# EAGLE design Mixer-Analog-LM3900-Rev-C (EAGLE 8.4.3)
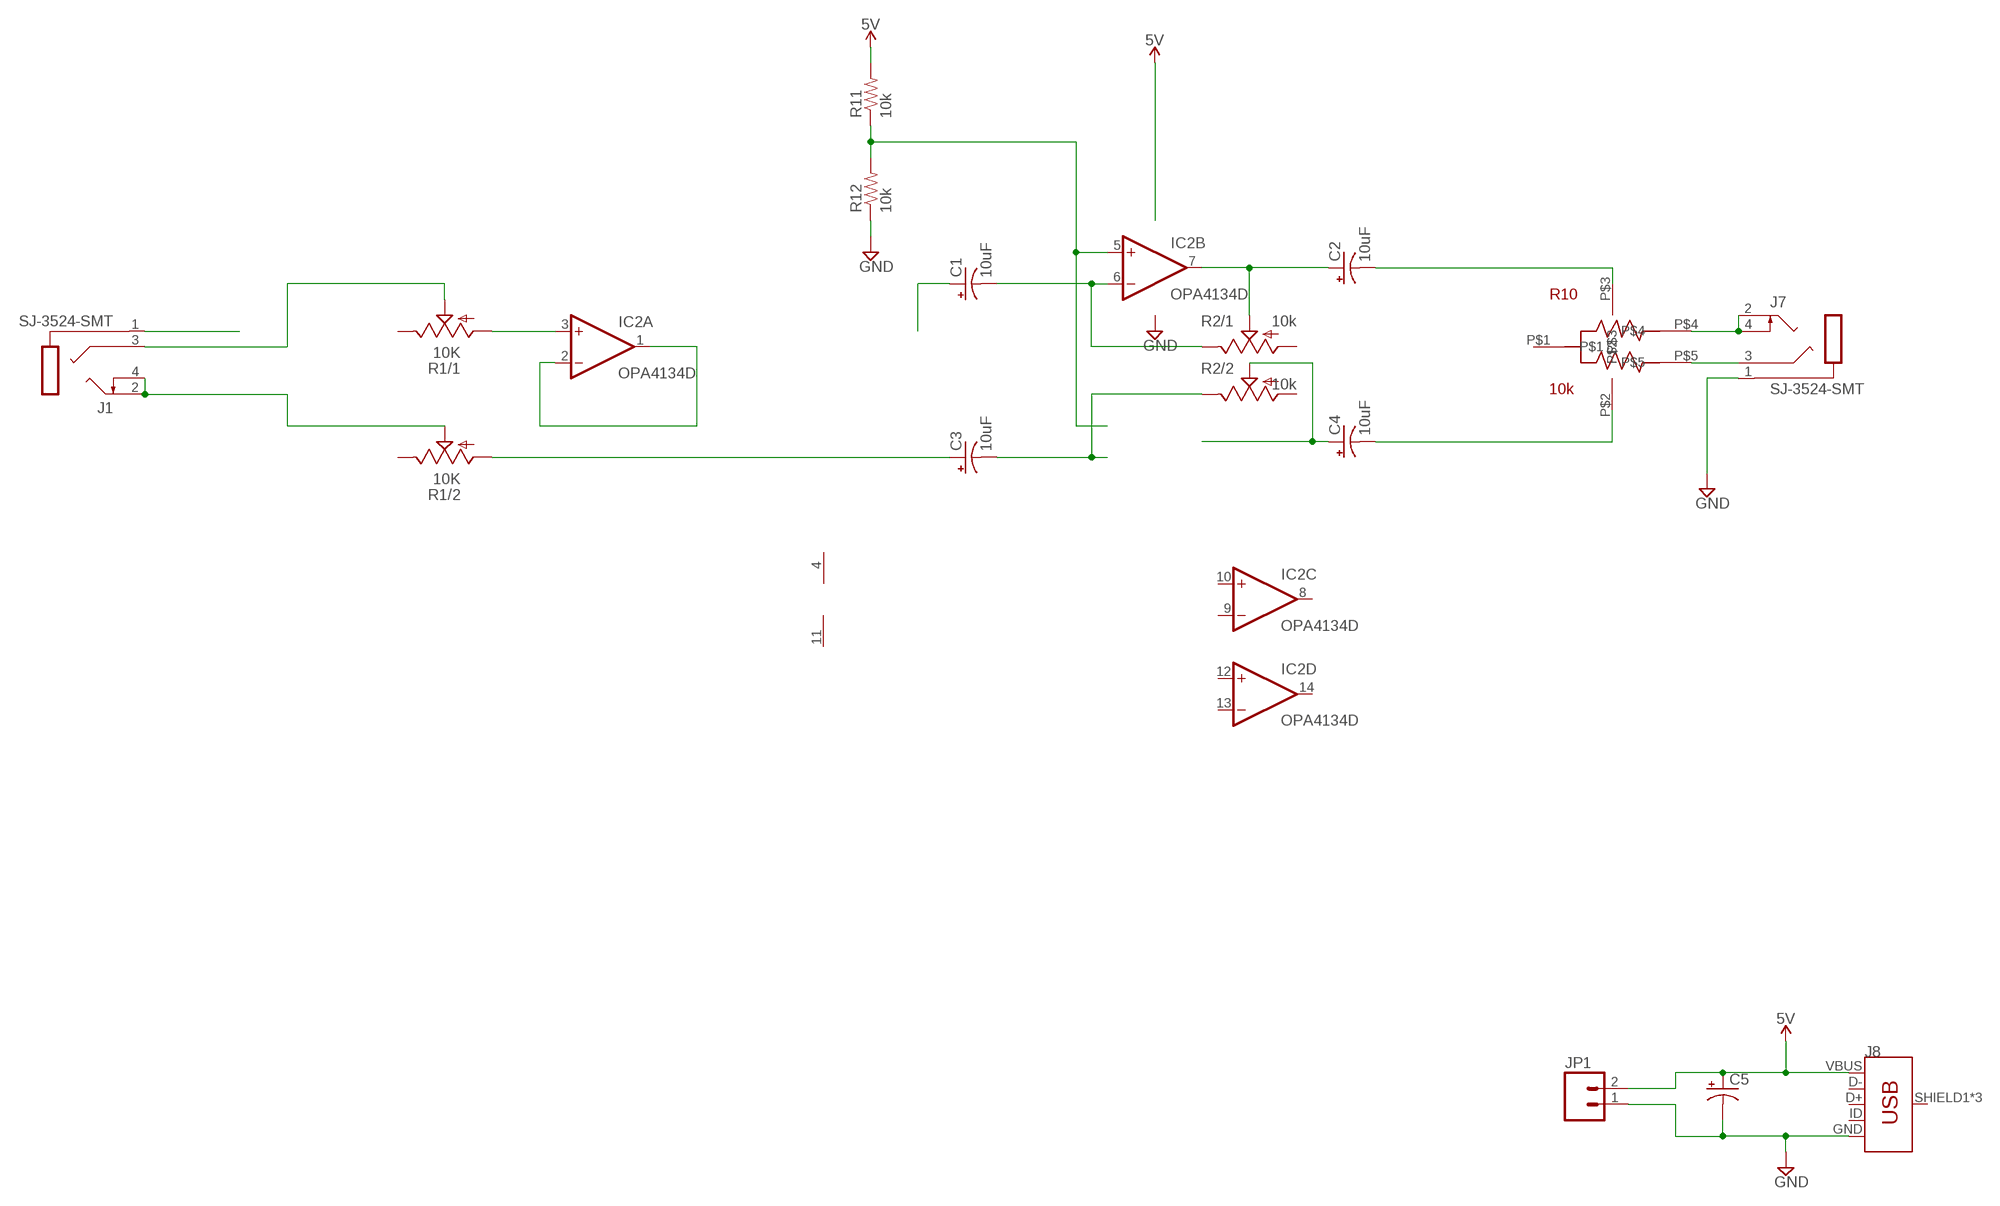
[diagram p0: schematic, sheet 1]

## Parts
C1  10uF  CAP_POL1206-KIT  [EIA3216-KIT]
C2  10uF  CAP_POL1206-KIT  [EIA3216-KIT]
C3  10uF  CAP_POL1206-KIT  [EIA3216-KIT]
C4  10uF  CAP_POL1206-KIT  [EIA3216-KIT]
C5  CAP_POLPTH1  [CPOL-RADIAL-100UF-25V]
IC2  OPA4134D  [SO14]
J1  SJ-3524-SMT  [SJ-3524-SMT]
J7  SJ-3524-SMT  [SJ-3524-SMT]
J8  USB_MICRO-B_FEMALE-SMT  [USB-B-MICRO-SMD]
JP1  M02LOCK  [1X02_LOCK]
R1  10K  POT-DUAL-PTV112-4420  [PTV112]
R2  10k  POT-DUAL-PTV112-4420  [PTV112]
R10  10k  POT-DUAL-ALPS-RK10J12E0A0A  [POT-DUAL-ALPS-RK10J12E0A0A]
R11  10k  RESISTOR1206  [1206]
R12  10k  RESISTOR1206  [1206]

## Nets
5V: C5.1(+) J8.VBUS JP1.2 R11.2
DLE: C2.A(+) IC2.7(B:OUT) R2.1.2(/1:S)
GND: C5.2(-) J7.1(S) J8.GND JP1.1 R12.1
N$1: C3.C(-) R2.2.3(/2:E)
N$2: IC2.5(B:+IN) R11.1 R12.2
N$3: IC2.3(A:+IN) R1.1.1(/1:A)
N$4: IC2.1(A:OUT) IC2.2(A:-IN)
N$6: J1.1(S)
N$7: C4.C(-) R10.P$2
N$21: C1.C(-) IC2.6(B:-IN) R2.1.3(/1:E)
N$24: C4.A(+) R2.2.2(/2:S)
N$35: C3.A(+) R1.2.1(/2:A)
N$36: C1.A(+)
N$37: J1.2(T) J1.4(TS) R1.2.2(/2:S)
N$40: J1.3(R) R1.1.2(/1:S)
N$61: J7.2(T) J7.4(TS) R10.P$4
N$62: J7.3(R) R10.P$5
N$111: C2.C(-) R10.P$3
Unconnected: IC2.8(C:OUT) IC2.9(C:-IN) IC2.10(C:+IN) IC2.12(D:+IN) IC2.13(D:-IN) IC2.14(D:OUT) J8.D+ J8.D- J8.ID J8.SHIELD1(SHIELD) J8.SHIELD2(SHIELD) J8.SHIELD3(SHIELD) R1.1.3(/1:E) R1.2.3(/2:E) R2.1.1(/1:A) R2.2.1(/2:A) R10.P$1

## Power pins joined to a net without a drawn wire
V+: IC2.4(P:V+)
V-: IC2.11(P:V-)

## Library data of the parts
C1-C5 = SparkFun-Passives:CAP_POL: Capacitor Polarized These are standard SMD and PTH capacitors. Normally 10uF, 47uF, and 100uF in electrolytic and tantalum varieties. Always verify the external diameter of the through hole cap, it varies with capacity, voltage, and manufacturer. The EIA devices should be standard.
IC2 = linear:OPA4134: SoundPLUS (TM) High Performance AUDIO OPERATIONAL AMPLIFIERS Source: http://focus.ti.com/lit/ds/sbos058/sbos058.pdf
J1 J7 = con-cuistack:SJ-3524: 3.5 Stereo audio jack (SMT)
J8 = SparkFun-Connectors:USB_MICRO-B: USB Type Micro-B Connector Male/female and PTH/SMT variants SparkFun Products: SparkFun microB USB Breakout <https://www.sparkfun.com/products/12035> SparkFun USB microB Plug Breakout <https://www.sparkfun.com/products/10031> SparkFun ESP8266 Thing <https://www.sparkfun.com/products/13231>; PROD_ID: CONN-11752
JP1 = CMU-ArtFab:M02: Header 2 Standard 2-pin 0.1" header. Use with straight break away headers (SKU : PRT-00116), right angle break away headers (PRT-00553), swiss pins (PRT-00743), machine pins (PRT-00117), and female headers (PRT-00115). Molex polarized connector foot print use with SKU : PRT-08233 with associated crimp pins and housings.
R1 R2 = CMU-ArtFab:POT-DUAL-PTV112: Bourns 11mm dual potentiometer; AVAILABILITY: Unavailable; DESCRIPTION: Alt# Tce-10111410; MF: STMicroelectronics; MP: PTV112; PACKAGE: None; PRICE: None
R10 = CMU-ArtFab:POT-DUAL-ALPS-RK10J12E0A0A
R11 R12 = SparkFun-Passives:RESISTOR: Resistor Basic schematic elements and footprints for 0603, 1206, and PTH resistors.

## Board
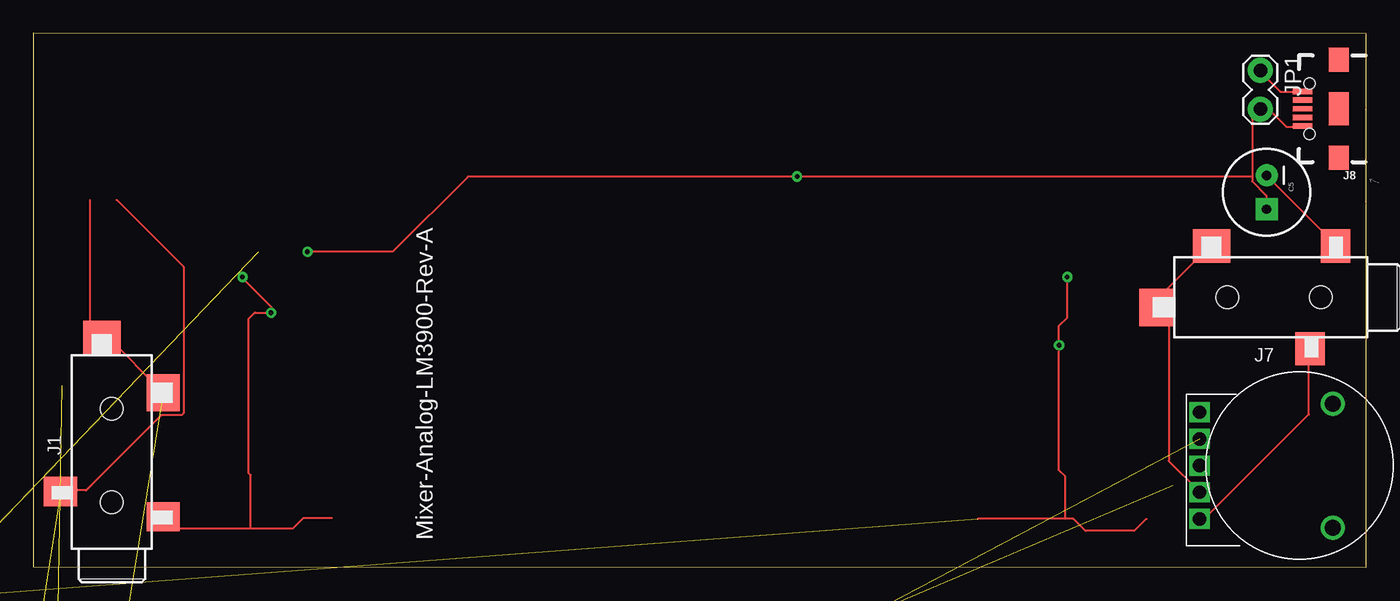
[diagram p1: board, top side]
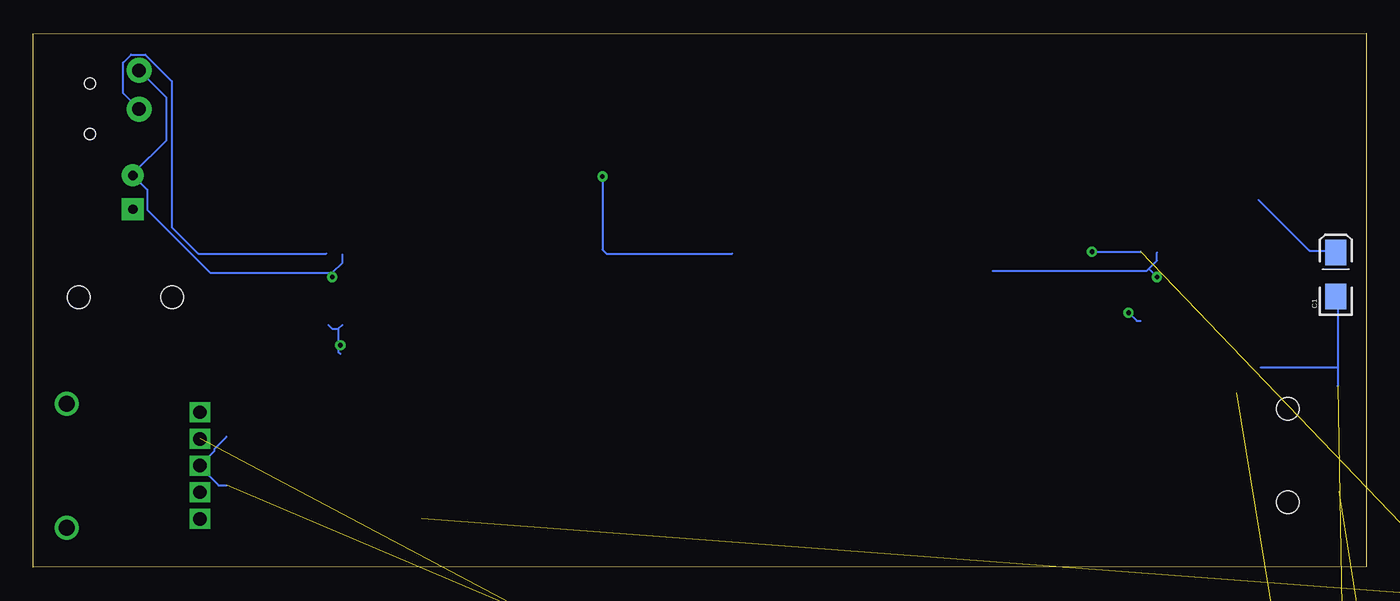
[diagram p2: board, bottom side, seen from below]

Size 100 x 40.05 mm. Coordinates in mm from the lower left corner, seen from the top.
Outline: 0,0.05 100,0 100,40 0,40.05 0,0.05
Copper layers (1*16): Top 0.035mm / dielectric 1.5mm / Bottom 0.035mm
Design rules "default": minimum track width 6mil, minimum drill 0.35mm, track to track 6mil, track to pad 6mil, pad to pad 6mil, via to via 6mil, smd to smd 6mil, copper to edge 40mil, drill to drill 6mil, minimum pad ring 10mil, minimum via ring 8mil, stop-mask expansion 4mil, vias tented up to drill 0mil, thermal gap 10mil

### Footprints (pad centres in the part's own frame; a part is rotated, then mirrored left to right if it is on the bottom)
EIA3216-KIT = smd 1.9 x 1.6: A 1.65,0; C -1.65,0
CPOL-RADIAL-100UF-25V = drill 0.7 pad 1.651 square: 1 1.27,0 | drill 0.7 pad 1.651: 2 -1.27,0
SO14 = smd 0.6 x 2.2: 1 -3.81,-2.6; 2 -2.54,-2.6; 3 -1.27,-2.6; 4 0,-2.6; 5 1.27,-2.6; 6 2.54,-2.6; 7 3.81,-2.6; 8 3.81,2.6; 9 2.54,2.6; 10 1.27,2.6; 11 0,2.6; 12 -1.27,2.6; 13 -2.54,2.6; 14 -3.81,2.6
SJ-3524-SMT = smd 2.5 x 2.2: 1 3.85,-4.6; 3 -3.85,-2.7 | smd 2.5 x 2.8: 2 3.85,4.7 | smd 2.8 x 2.5: 4 -0.75,8.85 | hole 1.7: 0,-3.5; 0,3.5
USB-B-MICRO-SMD = smd 1.45 x 0.4: D+ 2.725,0; D- 2.725,0.65; GND 2.725,-1.3; ID 2.725,-0.65; VBUS 2.725,1.3 | smd 1.5 x 1.8: SHIELD1 0,3.685; SHIELD2 0,-3.685 | smd 1.5 x 2.5: SHIELD3 0,0 | hole 0.85: 2.2,1.9; 2.2,-1.9
1X02_LOCK = drill 1.016 pad 1.88: 1 -0.178,0; 2 2.718,0
PTV112 = drill 1.1 pad 1.676: 1.1 -3,-11; 1.2 -5,-11; 1.3 5,-11; 2.1 -1,-11; 2.2 1,-11; 2.3 3,-11 | drill 1.6 pad 2.8 square: M1 -6.8,0; M2 6.8,0
POT-DUAL-ALPS-RK10J12E0A0A = drill 1 pad 1.321 square: P$1 -4,0; P$2 -2,0; P$3 0,0; P$4 2,0; P$5 4,0 | drill 1.2: P$6 4.65,10; P$7 -4.65,10
1206 = smd 1.6 x 1.8: 1 -1.4,0; 2 1.4,0

### Placement (x,y rotation side)
C1  2.28,21.96 90 bottom
C2  -12,-35.95 0 top  (outside the outline)
C3  -12,-39.95 0 top  (outside the outline)
C4  -12,-43.95 0 top  (outside the outline)
C5  92.53,28.13 270 top
IC2  -20,-118.95 0 top  (outside the outline)
J1  5.89,8.4 0 top
J7  93.09,20.25 90 top
J8  97.96,34.39 180 top
JP1  92.06,37.09 270 top
R1  -5,-59.95 0 top  (outside the outline)
R2  -5,-93.95 0 top  (outside the outline)
R10  87.5,7.63 270 top
R11  -10,-2.95 0 top  (outside the outline)
R12  -15,-2.95 0 top  (outside the outline)

### Tracks (layer width: path | path; a pad name or v marks a point on that pad's centre or on a via)
5V  (via drill 0.35)  (1 unrouted)
  Top 0.152: 91.44,29.31 91.44,33.66 92.05,34.27 JP1.2 92.68,34.37 94,33.05 95.19,33.05 J8.VBUS | 91.44,29.31 91.44,28.94 92.51,27.87 92.51,26.96 C5.1 | v20.57,23.67 26.98,23.67 32.61,29.31 v57.3,29.31 91.44,29.31
  Bottom 0.152: v20.57,23.67 16.92,23.67 | 47.55,23.52 57,23.52 57.3,23.82 v57.3,29.31 | 78.03,23.52 87.63,23.52 89.61,25.5 89.61,36.47 91.59,38.45 92.66,38.45 93.27,37.84 93.27,35.56 92.2,34.49 JP1.2
DLE  (2 unrouted)
GND  (via drill 0.35)  (1 unrouted)
  Top 0.152: J7.1 97.69,24.21 92.51,29.4 C5.2 | 77.42,3.64 78.03,3.64 78.94,2.73 82.6,2.73 83.52,3.64 | 77.42,3.64 70.87,3.64 | 77.42,3.64 77.42,6.84 76.96,7.3 v76.96,16.66 76.96,18.12 77.57,18.73 v77.57,21.78 | JP1.1 92.06,37.18 93.56,35.68 J8.GND
  Bottom 0.152: 76.81,23.45 76.81,22.84 77.57,22.08 | 77.57,22.08 86.72,22.08 91.44,26.81 91.44,28.33 92.51,29.4 C5.2 92.53,29.52 90,32.05 90,35.21 JP1.1 | 76.96,15.99 77.11,16.14 77.11,16.66 | v77.57,21.78 77.57,22.08 | 77.11,17.88 77.11,16.66 | 76.81,18.19 77.11,17.88 | 77.11,17.88 77.57,17.88 77.88,18.19 | v76.96,16.66 77.11,16.66
N$1  (1 unrouted)
N$2  (2 unrouted)
N$3  (1 unrouted)
N$4  (1 unrouted)
N$6  (via drill 0.35)
  Top 0.152: v15.7,21.78 15.7,21.69 17.83,19.56 v17.83,19.1 16.61,19.1 16.15,18.64 16.15,7.06 16.31,6.91 16.31,2.95 | 22.4,3.71 20.27,3.71 19.51,2.95 16.31,2.95 | 16.31,2.95 10.52,2.95 9.75,3.71 J1.1
  Bottom 0.152: 15.7,23.61 15.7,23 16.31,22.39 | 16.31,22.39 16.46,22.23 28.04,22.23 | 16.31,22.39 v15.7,21.78 | 16.92,18.49 17.22,18.49 v17.83,19.1
N$7  (1 unrouted)
N$21  (2 unrouted)
  Bottom 0.152: 2.13,14.99 2.13,20.17 C1.C | 2.13,14.99 2.13,13.61 | 2.13,14.99 7.92,14.99
N$24  (1 unrouted)
N$35  (1 unrouted)
N$36
  Bottom 0.152: 8.08,27.57 4.27,23.76 2.29,23.76 C1.A
N$37  (1 unrouted)
  Top 0.152: J1.2 9.6,13.24 5.64,17.2 5.18,17.2 J1.4 5.03,17.36 4.27,18.12 4.27,27.57
N$40  (1 unrouted)
  Top 0.152: 6.25,27.57 11.28,22.54 11.28,11.57 11.12,11.41 9.6,11.41 3.96,5.77 2.13,5.77 J1.3
N$61
  Top 0.152: J7.2 88.24,24.06 84.28,20.1 84.28,19.64 J7.4 84.28,19.41 85.19,18.49 85.19,7.97 87.48,5.69 R10.P$4
N$62
  Top 0.152: J7.3 95.71,16.36 95.71,11.48 87.94,3.71 87.63,3.71 R10.P$5
N$111  (1 unrouted)
  Bottom 0.152: 85.5,6.15 86.11,6.15 87.48,7.52 R10.P$3 87.48,7.67 86.41,8.74 86.41,8.89 85.5,9.8

### Text on the board
tNames: Mixer-Analog-LM3900-Rev-A